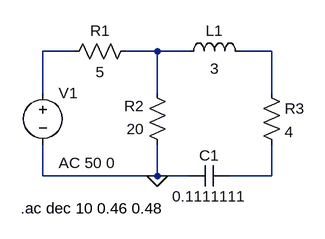
[diagram p0: schematic Draft4.asc]
Draft4.asc, the LTspice schematic file:
Version 4
SHEET 1 880 680
WIRE 176 48 128 48
WIRE 304 48 256 48
WIRE 352 48 304 48
WIRE 480 48 432 48
WIRE 128 112 128 48
WIRE 304 112 304 48
WIRE 480 112 480 48
WIRE 128 240 128 192
WIRE 304 240 304 192
WIRE 304 240 128 240
WIRE 352 240 304 240
WIRE 480 240 480 192
WIRE 480 240 416 240
FLAG 304 240 0
SYMBOL voltage 128 96 R0
WINDOW 123 24 124 Left 2
WINDOW 39 0 0 Left 0
SYMATTR InstName V1
SYMATTR Value ""
SYMATTR Value2 AC 50 0
SYMBOL res 272 32 R90
WINDOW 0 0 56 VBottom 2
WINDOW 3 32 56 VTop 2
SYMATTR InstName R1
SYMATTR Value 5
SYMBOL res 320 208 R180
WINDOW 0 36 76 Left 2
WINDOW 3 36 40 Left 2
SYMATTR InstName R2
SYMATTR Value 20
SYMBOL ind 336 64 R270
WINDOW 0 32 56 VTop 2
WINDOW 3 5 56 VBottom 2
SYMATTR InstName L1
SYMATTR Value 3
SYMBOL cap 416 224 R90
WINDOW 0 0 32 VBottom 2
WINDOW 3 32 32 VTop 2
SYMATTR InstName C1
SYMATTR Value 0.1111111
SYMBOL res 464 96 R0
SYMATTR InstName R3
SYMATTR Value 4
TEXT 94 290 Left 2 !.ac dec 10 0.46 0.48

The netlist it stands for:
* Draft4.asc
V1 N001 0 AC 50 0
R1 N002 N001 5
R2 0 N002 20
L1 N002 N003 3
C1 N004 0 0.1111111
R3 N003 N004 4
.ac dec 10 0.46 0.48
.backanno
.end